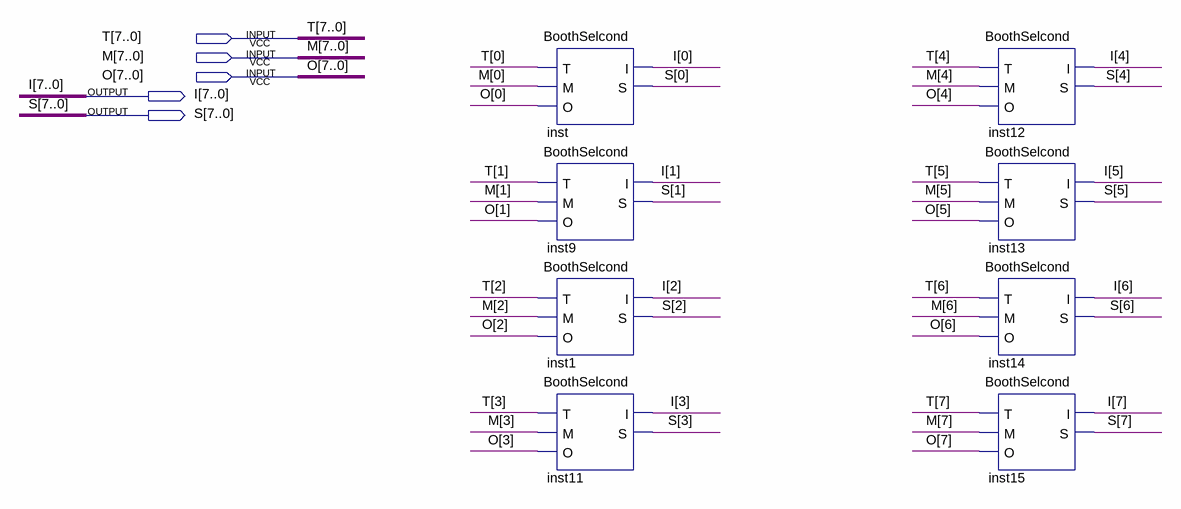
[diagram p0: schematic sheet]
// Quartus schematic BoothSelcond16b.bdf as structural Verilog: 8 symbols, 5 pins
module BoothSelcond16b (
  input  [7:0] T,
  input  [7:0] M,
  input  [7:0] O,
  output [7:0] I,
  output [7:0] S
);

  BoothSelcond inst (.T(T[0]), .M(M[0]), .O(O[0]), .I(I[0]), .S(S[0]));
  BoothSelcond inst9 (.T(T[1]), .M(M[1]), .O(O[1]), .I(I[1]), .S(S[1]));
  BoothSelcond inst1 (.T(T[2]), .M(M[2]), .O(O[2]), .I(I[2]), .S(S[2]));
  BoothSelcond inst11 (.T(T[3]), .M(M[3]), .O(O[3]), .I(I[3]), .S(S[3]));
  BoothSelcond inst12 (.T(T[4]), .M(M[4]), .O(O[4]), .I(I[4]), .S(S[4]));
  BoothSelcond inst13 (.T(T[5]), .M(M[5]), .O(O[5]), .I(I[5]), .S(S[5]));
  BoothSelcond inst14 (.T(T[6]), .M(M[6]), .O(O[6]), .I(I[6]), .S(S[6]));
  BoothSelcond inst15 (.T(T[7]), .M(M[7]), .O(O[7]), .I(I[7]), .S(S[7]));
endmodule
